# EAGLE design G778A (EAGLE 6.6.0)
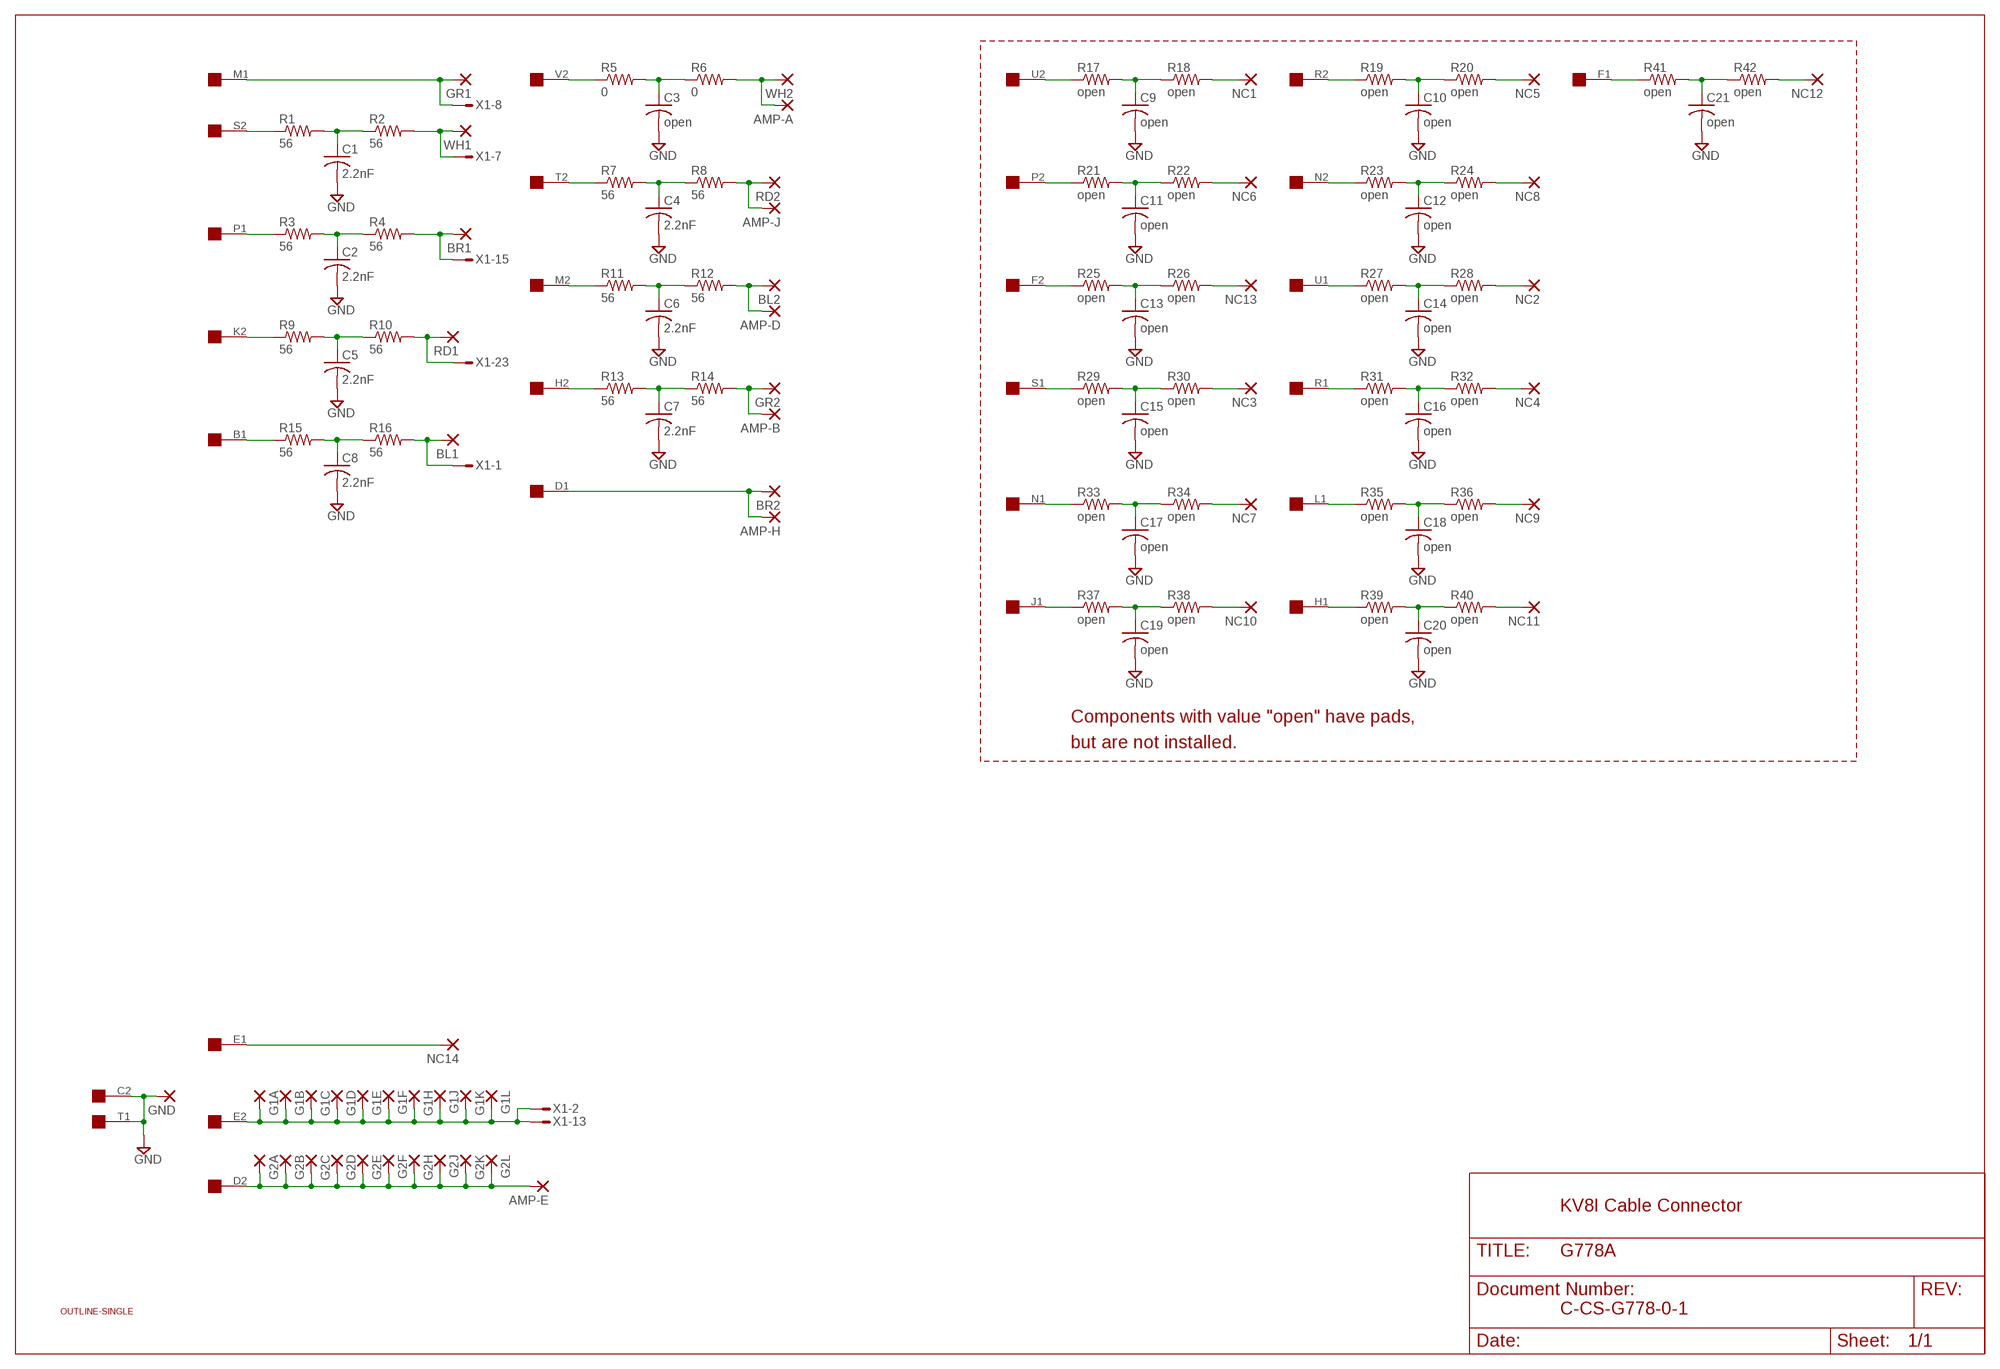
[diagram p0: schematic, sheet 1]

## Parts
AMP-A  2,54/1,0  [2,54/1,0]
AMP-B  2,54/1,0  [2,54/1,0]
AMP-D  2,54/1,0  [2,54/1,0]
AMP-E  2,54/1,0  [2,54/1,0]
AMP-H  2,54/1,0  [2,54/1,0]
AMP-J  2,54/1,0  [2,54/1,0]
BL1  2,54/1,0  [2,54/1,0]
BL2  2,54/1,0  [2,54/1,0]
BR1  2,54/1,0  [2,54/1,0]
BR2  2,54/1,0  [2,54/1,0]
C1  2.2nF  C-US102-043X133  [C102-043X133]
C2  2.2nF  C-US102-043X133  [C102-043X133]
C3  open  C-US102-043X133  [C102-043X133]
C4  2.2nF  C-US102-043X133  [C102-043X133]
C5  2.2nF  C-US102-043X133  [C102-043X133]
C6  2.2nF  C-US102-043X133  [C102-043X133]
C7  2.2nF  C-US102-043X133  [C102-043X133]
C8  2.2nF  C-US102-043X133  [C102-043X133]
C9  open  C-US102-043X133  [C102-043X133]
C10  open  C-US102-043X133  [C102-043X133]
C11  open  C-US102-043X133  [C102-043X133]
C12  open  C-US102-043X133  [C102-043X133]
C13  open  C-US102-043X133  [C102-043X133]
C14  open  C-US102-043X133  [C102-043X133]
C15  open  C-US102-043X133  [C102-043X133]
C16  open  C-US102-043X133  [C102-043X133]
C17  open  C-US102-043X133  [C102-043X133]
C18  open  C-US102-043X133  [C102-043X133]
C19  open  C-US102-043X133  [C102-043X133]
C20  open  C-US102-043X133  [C102-043X133]
C21  open  C-US102-043X133  [C102-043X133]
G1A  2,54/1,0  [2,54/1,0]
G1B  2,54/1,0  [2,54/1,0]
G1C  2,54/1,0  [2,54/1,0]
G1D  2,54/1,0  [2,54/1,0]
G1E  2,54/1,0  [2,54/1,0]
G1F  2,54/1,0  [2,54/1,0]
G1H  2,54/1,0  [2,54/1,0]
G1J  2,54/1,0  [2,54/1,0]
G1K  2,54/1,0  [2,54/1,0]
G1L  2,54/1,0  [2,54/1,0]
G2A  2,54/1,0  [2,54/1,0]
G2B  2,54/1,0  [2,54/1,0]
G2C  2,54/1,0  [2,54/1,0]
G2D  2,54/1,0  [2,54/1,0]
G2E  2,54/1,0  [2,54/1,0]
G2F  2,54/1,0  [2,54/1,0]
G2H  2,54/1,0  [2,54/1,0]
G2J  2,54/1,0  [2,54/1,0]
G2K  2,54/1,0  [2,54/1,0]
G2L  2,54/1,0  [2,54/1,0]
GND  2,54/1,0  [2,54/1,0]
GR1  2,54/1,0  [2,54/1,0]
GR2  2,54/1,0  [2,54/1,0]
NC1  2,54/1,0  [2,54/1,0]
NC2  2,54/1,0  [2,54/1,0]
NC3  2,54/1,0  [2,54/1,0]
NC4  2,54/1,0  [2,54/1,0]
NC5  2,54/1,0  [2,54/1,0]
NC6  2,54/1,0  [2,54/1,0]
NC7  2,54/1,0  [2,54/1,0]
NC8  2,54/1,0  [2,54/1,0]
NC9  2,54/1,0  [2,54/1,0]
NC10  2,54/1,0  [2,54/1,0]
NC11  2,54/1,0  [2,54/1,0]
NC12  2,54/1,0  [2,54/1,0]
NC13  2,54/1,0  [2,54/1,0]
NC14  2,54/1,0  [2,54/1,0]
R1  56  R-US_0207/10  [0207/10]
R2  56  R-US_0207/10  [0207/10]
R3  56  R-US_0207/10  [0207/10]
R4  56  R-US_0207/10  [0207/10]
R5  0  R-US_0207/10  [0207/10]
R6  0  R-US_0207/10  [0207/10]
R7  56  R-US_0207/10  [0207/10]
R8  56  R-US_0207/10  [0207/10]
R9  56  R-US_0207/10  [0207/10]
R10  56  R-US_0207/10  [0207/10]
R11  56  R-US_0207/10  [0207/10]
R12  56  R-US_0207/10  [0207/10]
R13  56  R-US_0207/10  [0207/10]
R14  56  R-US_0207/10  [0207/10]
R15  56  R-US_0207/10  [0207/10]
R16  56  R-US_0207/10  [0207/10]
R17  open  R-US_0207/10  [0207/10]
R18  open  R-US_0207/10  [0207/10]
R19  open  R-US_0207/10  [0207/10]
R20  open  R-US_0207/10  [0207/10]
R21  open  R-US_0207/10  [0207/10]
R22  open  R-US_0207/10  [0207/10]
R23  open  R-US_0207/10  [0207/10]
R24  open  R-US_0207/10  [0207/10]
R25  open  R-US_0207/10  [0207/10]
R26  open  R-US_0207/10  [0207/10]
R27  open  R-US_0207/10  [0207/10]
R28  open  R-US_0207/10  [0207/10]
R29  open  R-US_0207/10  [0207/10]
R30  open  R-US_0207/10  [0207/10]
R31  open  R-US_0207/10  [0207/10]
R32  open  R-US_0207/10  [0207/10]
R33  open  R-US_0207/10  [0207/10]
R34  open  R-US_0207/10  [0207/10]
R35  open  R-US_0207/10  [0207/10]
R36  open  R-US_0207/10  [0207/10]
R37  open  R-US_0207/10  [0207/10]
R38  open  R-US_0207/10  [0207/10]
R39  open  R-US_0207/10  [0207/10]
R40  open  R-US_0207/10  [0207/10]
R41  open  R-US_0207/10  [0207/10]
R42  open  R-US_0207/10  [0207/10]
RD1  2,54/1,0  [2,54/1,0]
RD2  2,54/1,0  [2,54/1,0]
U$1  SINGLE  [EDGE-CON2]
U$2  OUTLINE-SINGLE  [SINGLE]
WH1  2,54/1,0  [2,54/1,0]
WH2  2,54/1,0  [2,54/1,0]
X1  M25VS  [M25V]

## Nets
GND [supply]: C1.2 C2.2 C3.2 C4.2 C5.2 C6.2 C7.2 C8.2 C9.2 C10.2 C11.2 C12.2 C13.2 C14.2 C15.2 C16.2 C17.2 C18.2 C19.2 C20.2 C21.2 GND.1(P) U$1.C2 U$1.T1
N$1: C1.1 R1.2 R2.1
N$2: R1.1 U$1.S2
N$3: R2.2 WH1.1(P) X1.7
N$4: C2.1 R3.2 R4.1
N$5: R3.1 U$1.P1
N$6: BR1.1(P) R4.2 X1.15
N$7: GR1.1(P) U$1.M1 X1.8
N$8 [supply]: G1A.1(P) G1B.1(P) G1C.1(P) G1D.1(P) G1E.1(P) G1F.1(P) G1H.1(P) G1J.1(P) G1K.1(P) G1L.1(P) U$1.E2 X1.2 X1.13
N$9 [supply]: AMP-E.1(P) G2A.1(P) G2B.1(P) G2C.1(P) G2D.1(P) G2E.1(P) G2F.1(P) G2H.1(P) G2J.1(P) G2K.1(P) G2L.1(P) U$1.D2
N$10: C3.1 R5.2 R6.1
N$11: R5.1 U$1.V2
N$12: AMP-A.1(P) R6.2 WH2.1(P)
N$13: C4.1 R7.2 R8.1
N$14: R7.1 U$1.T2
N$15: AMP-J.1(P) R8.2 RD2.1(P)
N$16: C5.1 R9.2 R10.1
N$17: R9.1 U$1.K2
N$18: R10.2 RD1.1(P) X1.23
N$19: C6.1 R11.2 R12.1
N$20: R11.1 U$1.M2
N$21: AMP-D.1(P) BL2.1(P) R12.2
N$22: C7.1 R13.2 R14.1
N$23: R13.1 U$1.H2
N$24: AMP-B.1(P) GR2.1(P) R14.2
N$25: C8.1 R15.2 R16.1
N$26: R15.1 U$1.B1
N$27: BL1.1(P) R16.2 X1.1
N$28: C9.1 R17.2 R18.1
N$29: R17.1 U$1.U2
N$30: NC1.1(P) R18.2
N$31: C10.1 R19.2 R20.1
N$32: R19.1 U$1.R2
N$33: NC5.1(P) R20.2
N$34: C11.1 R21.2 R22.1
N$35: R21.1 U$1.P2
N$36: NC6.1(P) R22.2
N$37: C12.1 R23.2 R24.1
N$38: R23.1 U$1.N2
N$39: NC8.1(P) R24.2
N$40: C13.1 R25.2 R26.1
N$41: R25.1 U$1.F2
N$42: NC13.1(P) R26.2
N$43: C14.1 R27.2 R28.1
N$44: R27.1 U$1.U1
N$45: NC2.1(P) R28.2
N$46: C15.1 R29.2 R30.1
N$47: R29.1 U$1.S1
N$48: NC3.1(P) R30.2
N$49: C16.1 R31.2 R32.1
N$50: R31.1 U$1.R1
N$51: NC4.1(P) R32.2
N$52: C17.1 R33.2 R34.1
N$53: R33.1 U$1.N1
N$54: NC7.1(P) R34.2
N$55: C18.1 R35.2 R36.1
N$56: R35.1 U$1.L1
N$57: NC9.1(P) R36.2
N$58: C19.1 R37.2 R38.1
N$59: R37.1 U$1.J1
N$60: NC10.1(P) R38.2
N$61: C20.1 R39.2 R40.1
N$62: R39.1 U$1.H1
N$63: NC11.1(P) R40.2
N$64: C21.1 R41.2 R42.1
N$65: R41.1 U$1.F1
N$66: NC12.1(P) R42.2
N$67: AMP-H.1(P) BR2.1(P) U$1.D1
N$68: NC14.1(P) U$1.E1
Unconnected: U$1.A1 U$1.A2 U$1.B2 U$1.C1 U$1.J2 U$1.K1 U$1.L2 U$1.V1 X1.3 X1.4 X1.5 X1.6 X1.9 X1.10 X1.11 X1.12 X1.14 X1.16 X1.17 X1.18 X1.19 X1.20 X1.21 X1.22 X1.24 X1.25

## Notes on the sheet
- Components with value "open" have pads,
- but are not installed.
- KV8I Cable Connector
- C-CS-G778-0-1

## Library data of the parts
AMP-A AMP-B AMP-D AMP-E AMP-H AMP-J BL1 BL2 BR1 BR2 G1A G1B G1C G1D G1E G1F G1H G1J G1K G1L G2A G2B G2C G2D G2E G2F G2H G2J G2K G2L GND GR1 GR2 NC1-NC14 RD1 RD2 WH1 WH2 = wirepad:2,54/1,0: THROUGH-HOLE PAD
C1-C21 = rcl:C-US: CAPACITOR, American symbol
R1-R42 = rcl:R-US_: RESISTOR, American symbol
U$1 = dec-con:SINGLE: Single-Height DEC board
U$2 = dec-con:OUTLINE-*: Board outlines for DEC boards.
X1 = con-subd:M25?S: SUB-D; OC_FARNELL: unknown; OC_NEWARK: unknown

## Net classes
1 supply: width 0.813 mm

## Board
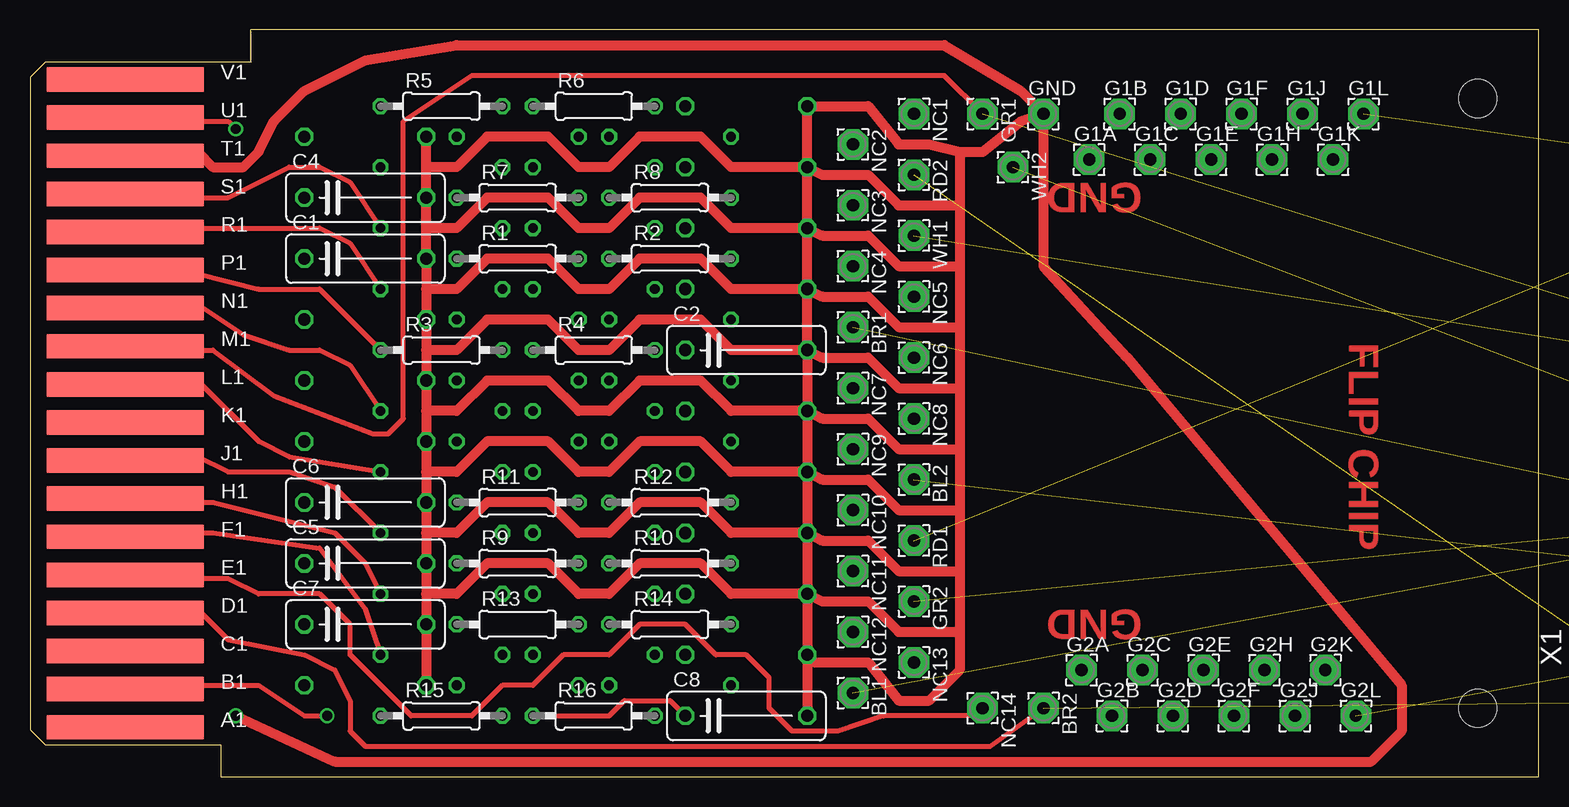
[diagram p1: board, top side]
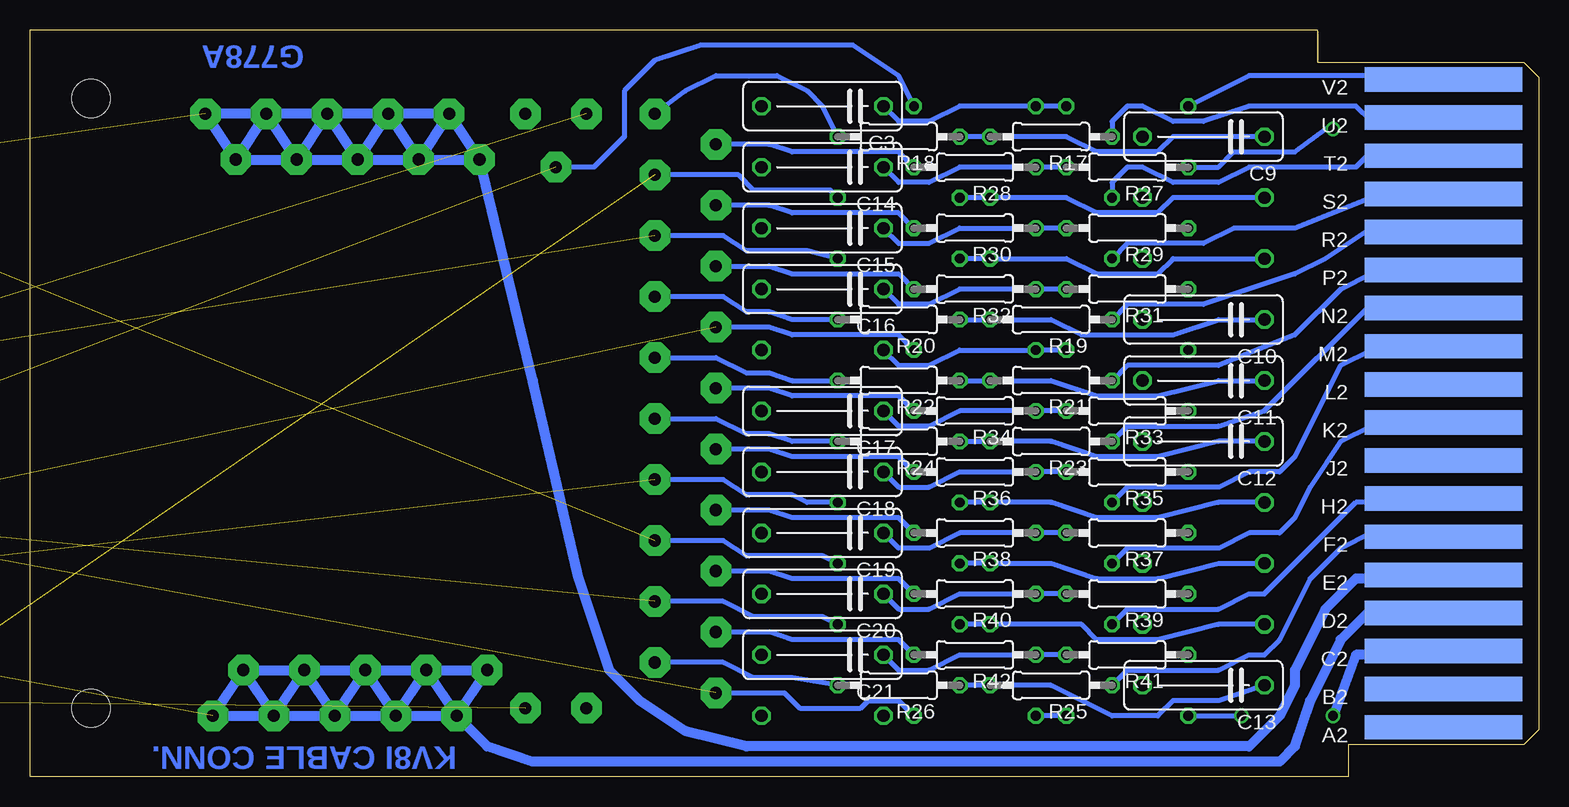
[diagram p2: board, bottom side, seen from below]

Size 125.73 x 62.23 mm. Coordinates in mm from the lower left corner, seen from the top.
Copper layers (1+16): Top 0.035mm / dielectric 1.5mm / Bottom 0.035mm
Design rules "16mils": minimum track width 16mil, minimum drill 32mil, track to track 15mil, track to pad 10mil, pad to pad 10mil, via to via 10mil, smd to smd 10mil, copper to edge 13mil, drill to drill 10mil, minimum pad ring 10mil, minimum via ring 8mil, stop-mask expansion 0mil, vias tented up to drill 0mil, thermal gap 10mil

### Footprints (pad centres in the part's own frame; a part is rotated, then mirrored left to right if it is on the bottom)
2,54/1,0 = drill 1.016 pad 2.54 octagon: 1 0,0
C102-043X133 = drill 1.016 octagon: 1 -5.08,0; 2 5.08,0
0207/10 = drill 0.813 octagon: 1 -5.08,0; 2 5.08,0
EDGE-CON2 = smd 13.106 x 2.032: A1 7.938,4.128; B1 7.938,7.303; C1 7.938,10.477; D1 7.938,13.652; E1 7.938,16.828; F1 7.938,20.003; H1 7.938,23.177; J1 7.938,26.352; K1 7.938,29.527; L1 7.938,32.703; M1 7.938,35.877; N1 7.938,39.053; P1 7.938,42.227; R1 7.938,45.403; S1 7.938,48.578; T1 7.938,51.752; U1 7.938,54.928; V1 7.938,58.102 | smd 13.106 x 2.032 bottom: A2 7.938,4.128; B2 7.938,7.303; C2 7.938,10.477; D2 7.938,13.652; E2 7.938,16.828; F2 7.938,20.003; H2 7.938,23.177; J2 7.938,26.352; K2 7.938,29.527; L2 7.938,32.703; M2 7.938,35.877; N2 7.938,39.053; P2 7.938,42.227; R2 7.938,45.403; S2 7.938,48.578; T2 7.938,51.752; U2 7.938,54.928; V2 7.938,58.102
SINGLE = hole 3.175: 120.65,56.515; 120.65,5.715
M25V = drill 1.016 octagon: 1 -16.561,1.422; 2 -13.792,1.422; 3 -11.049,1.422; 4 -8.28,1.422; 5 -5.512,1.422; 6 -2.769,1.422; 7 0,1.422; 8 2.769,1.422; 9 5.512,1.422; 10 8.28,1.422; 11 11.049,1.422; 12 13.792,1.422; 13 16.561,1.422; 14 -15.189,-1.422; 15 -12.421,-1.422; 16 -9.652,-1.422; 17 -6.909,-1.422; 18 -4.14,-1.422; 19 -1.372,-1.422; 20 1.372,-1.422; 21 4.14,-1.422; 22 6.909,-1.422; 23 9.652,-1.422; 24 12.421,-1.422; 25 15.189,-1.422 | hole 3.302: 23.52,0; -23.52,0

### Placement (x,y rotation side)
AMP-A  144.78,26.67 0 top  (outside the outline)
AMP-B  144.78,21.59 0 top  (outside the outline)
AMP-D  144.78,16.51 0 top  (outside the outline)
AMP-E  144.78,11.43 0 top  (outside the outline)
AMP-H  144.78,6.35 0 top  (outside the outline)
AMP-J  144.78,1.27 0 top  (outside the outline)
BL1  68.58,6.99 270 top
BL2  73.66,24.77 270 top
BR1  68.58,37.47 270 top
BR2  84.46,5.71 270 top
C1  27.94,43.18 0 top
C2  59.69,35.56 0 top
C3  59.69,55.88 180 bottom
C4  27.94,48.26 0 top
C5  27.94,17.78 0 top
C6  27.94,22.86 0 top
C7  27.94,12.7 0 top
C8  59.69,5.08 0 top
C9  27.94,53.34 180 bottom
C10  27.94,38.1 180 bottom
C11  27.94,33.02 180 bottom
C12  27.94,27.94 180 bottom
C13  27.94,7.62 180 bottom
C14  59.69,50.8 180 bottom
C15  59.69,45.72 180 bottom
C16  59.69,40.64 180 bottom
C17  59.69,30.48 180 bottom
C18  59.69,25.4 180 bottom
C19  59.69,20.32 180 bottom
C20  59.69,15.24 180 bottom
C21  59.69,10.16 180 bottom
G1A  88.27,51.44 0 top
G1B  90.81,55.24 0 top
G1C  93.35,51.44 0 top
G1D  95.89,55.24 0 top
G1E  98.43,51.44 0 top
G1F  100.97,55.24 0 top
G1H  103.51,51.44 0 top
G1J  106.05,55.24 0 top
G1K  108.59,51.44 0 top
G1L  111.13,55.24 0 top
G2A  87.63,8.89 0 top
G2B  90.17,5.08 0 top
G2C  92.71,8.89 0 top
G2D  95.25,5.08 0 top
G2E  97.79,8.89 0 top
G2F  100.33,5.08 0 top
G2H  102.87,8.89 0 top
G2J  105.41,5.08 0 top
G2K  107.95,8.89 0 top
G2L  110.49,5.08 0 top
GND  84.46,55.24 0 top
GR1  79.38,55.24 270 top
GR2  73.66,14.61 270 top
NC1  73.66,55.24 270 top
NC2  68.58,52.7 270 top
NC3  68.58,47.62 270 top
NC4  68.58,42.55 270 top
NC5  73.66,40.01 270 top
NC6  73.66,34.92 270 top
NC7  68.58,32.38 270 top
NC8  73.66,29.84 270 top
NC9  68.58,27.3 270 top
NC10  68.58,22.23 270 top
NC11  68.58,17.14 270 top
NC12  68.58,12.06 270 top
NC13  73.66,9.53 270 top
NC14  79.38,5.71 270 top
R1  40.64,43.18 0 top
R2  53.34,43.18 0 top
R3  34.29,35.56 0 top
R4  46.99,35.56 0 top
R5  34.29,55.88 0 top
R6  46.99,55.88 0 top
R7  40.64,48.26 0 top
R8  53.34,48.26 0 top
R9  40.64,17.78 0 top
R10  53.34,17.78 0 top
R11  40.64,22.86 0 top
R12  53.34,22.86 0 top
R13  40.64,12.7 0 top
R14  53.34,12.7 0 top
R15  34.29,5.08 0 top
R16  46.99,5.08 0 top
R17  40.64,53.34 180 bottom
R18  53.34,53.34 180 bottom
R19  40.64,38.1 180 bottom
R20  53.34,38.1 180 bottom
R21  40.64,33.02 180 bottom
R22  53.34,33.02 180 bottom
R23  40.64,27.94 180 bottom
R24  53.34,27.94 180 bottom
R25  40.64,7.62 180 bottom
R26  53.34,7.62 180 bottom
R27  34.29,50.8 180 bottom
R28  46.99,50.8 180 bottom
R29  34.29,45.72 180 bottom
R30  46.99,45.72 180 bottom
R31  34.29,40.64 180 bottom
R32  46.99,40.64 180 bottom
R33  34.29,30.48 180 bottom
R34  46.99,30.48 180 bottom
R35  34.29,25.4 180 bottom
R36  46.99,25.4 180 bottom
R37  34.29,20.32 180 bottom
R38  46.99,20.32 180 bottom
R39  34.29,15.24 180 bottom
R40  46.99,15.24 180 bottom
R41  34.29,10.16 180 bottom
R42  46.99,10.16 180 bottom
RD1  73.66,19.68 270 top
RD2  73.66,50.16 270 top
U$1  0,0 0 top
U$2  0,0 0 top
WH1  73.66,45.09 270 top
WH2  81.92,50.8 270 top
X1  134.62,35.56 90 top  (outside the outline)

### Tracks (layer width: path | path; a pad name or v marks a point on that pad's centre or on a via)
GND  (via drill 0.81)
  Top 0.813: C2.2 C16.2 | C16.2 C15.2 | C15.2 C14.2 | C14.2 C3.2 69.85,55.88 72.39,52.7 74.93,52.7 77.47,52.07 | 33.02,15.24 C5.2 C6.2 C12.2 C11.2 C10.2 C1.2 C4.2 C9.2 | 33.02,15.24 C7.2 C13.2 | C2.2 C17.2 | C17.2 C18.2 | C18.2 C19.2 | C19.2 C20.2 | C20.2 C21.2 | C21.2 C8.2 | C20.2 58.42,15.24 55.88,17.78 50.8,17.78 48.26,15.24 45.72,15.24 43.18,17.78 38.1,17.78 35.56,15.24 33.02,15.24 | U$1.T1 8.89,52.07 13.97,52.07 15.24,50.8 17.78,50.8 19.05,52.07 20.32,54.61 22.86,57.15 27.94,59.69 35.56,60.96 76.2,60.96 82.55,57.15 GND.1 | GND.1 84.46,42.55 91.44,34.92 114.3,7.62 114.3,3.81 111.76,1.27 25.4,1.27 v17.15,5.08 | 77.47,52.07 77.47,12.06 | 77.47,12.06 77.47,8.89 74.93,6.35 72.39,6.35 69.85,9.53 65.41,9.53 C21.2 | 77.47,52.07 79.38,52.07 82.55,54.61 GND.1 | C14.2 58.42,50.8 55.88,53.34 50.8,53.34 48.26,50.8 45.72,50.8 43.18,53.34 38.1,53.34 35.56,50.8 33.02,50.8 | C15.2 58.42,45.72 55.88,48.26 50.8,48.26 48.26,45.72 45.72,45.72 43.18,48.26 38.1,48.26 35.56,45.72 33.02,45.72 | C16.2 58.42,40.64 55.88,43.18 50.8,43.18 48.26,40.64 45.72,40.64 43.18,43.18 38.1,43.18 35.56,40.64 33.02,40.64 | C2.2 58.42,35.56 55.88,38.1 50.8,38.1 48.26,35.56 45.72,35.56 43.18,38.1 38.1,38.1 35.56,35.56 33.02,35.56 | C17.2 58.42,30.48 55.88,33.02 50.8,33.02 48.26,30.48 45.72,30.48 43.18,33.02 38.1,33.02 35.56,30.48 33.02,30.48 | C19.2 58.42,20.32 55.88,22.86 50.8,22.86 48.26,20.32 45.72,20.32 43.18,22.86 38.1,22.86 35.56,20.32 33.02,20.32 | C18.2 58.42,25.4 55.88,27.94 50.8,27.94 48.26,25.4 45.72,25.4 43.18,27.94 38.1,27.94 35.56,25.4 33.02,25.4 | C20.2 66.04,14.61 69.85,14.61 72.39,12.06 77.47,12.06
  Top 0.813: C14.2 66.04,50.16 69.85,50.16 72.39,47.62 77.47,47.62 | C15.2 66.04,45.09 69.85,45.09 72.39,42.55 77.47,42.55 | C16.2 66.04,40.01 69.85,40.01 72.39,37.47 77.47,37.47 | C2.2 66.04,34.92 69.85,34.92 72.39,32.38 77.47,32.38 | C17.2 66.04,29.84 69.85,29.84 72.39,27.3 77.47,27.3 | C18.2 66.04,24.77 69.85,24.77 72.39,22.23 77.47,22.23 | C19.2 66.04,19.68 69.85,19.68 72.39,17.14 77.47,17.14
  Bottom 0.813: U$1.C2 10.16,10.16 15.24,10.16 v17.15,5.08
N$1
  Bottom 0.406: R2.1 R1.2 39.37,43.18 36.83,41.91 31.75,41.91 30.48,43.18 C1.1
N$2
  Bottom 0.406: U$1.S2 13.97,48.58 13.97,48.26 20.32,45.72 25.4,45.72 27.94,44.45 34.29,44.45 R1.1
N$3  (1 unrouted)
  Bottom 0.406: R2.2 60.96,43.81 66.04,43.81 67.95,45.09 WH1.1
N$4
  Bottom 0.406: C2.1 53.34,34.29 50.8,34.29 48.26,35.56 R4.1 R3.2
N$5
  Top 0.406: U$1.P1 8.89,41.91 13.97,41.91 19.05,40.64 24.13,40.64 R3.1
N$6  (1 unrouted)
  Bottom 0.406: R4.2 53.34,36.83 62.23,36.83 64.14,37.47 BR1.1
N$7  (1 unrouted)
  Top 0.406: GR1.1 76.2,58.42 36.83,58.42 31.12,54.61 31.12,29.84 29.85,28.57 28.58,28.57 20.32,31.75 15.24,35.56 8.89,35.56 U$1.M1
N$8  (2 unrouted)
  Bottom 0.813: U$1.E2 13.97,16.51 15.24,16.51 17.78,13.97 20.32,8.89 20.32,7.62 21.59,5.08 24.13,2.54 66.04,2.54 71.12,3.81 74.93,6.35 77.47,8.89 80.01,16.51 83.82,33.02 G1A.1 | G1B.1 G1A.1 | G1C.1 G1A.1 | G1C.1 G1B.1 | G1B.1 G1D.1 | G1E.1 G1C.1 | G1E.1 G1D.1 | G1D.1 G1F.1 | G1H.1 G1E.1 | G1H.1 G1F.1 | G1F.1 G1J.1 | G1K.1 G1H.1 | G1K.1 G1J.1 | G1J.1 G1L.1 G1K.1 | G1J.1 G1H.1 | G1F.1 G1E.1 | G1C.1 G1D.1
N$9  (1 unrouted)
  Bottom 0.813: U$1.D2 10.16,13.97 13.97,13.97 16.51,11.43 19.05,6.35 20.32,2.54 21.59,1.27 83.82,1.27 87.63,2.54 G2B.1 | G2B.1 G2A.1 G2C.1 | G2C.1 G2B.1 | G2D.1 G2C.1 | G2E.1 G2C.1 | G2E.1 G2D.1 | G2D.1 G2B.1 | G2J.1 G2L.1 G2K.1 | G2J.1 G2F.1 | G2F.1 G2D.1 | G2H.1 G2E.1 | G2E.1 G2F.1 | G2F.1 G2H.1 | G2H.1 G2J.1 | G2J.1 G2K.1 | G2K.1 G2H.1
N$10
  Bottom 0.406: R5.2 R6.1 48.26,55.88 50.8,54.61 53.34,54.61 C3.1
N$11
  Bottom 0.406: U$1.V2 8.89,58.42 24.13,58.42 R5.1
N$12  (1 unrouted)
  Bottom 0.406: R6.2 53.34,58.42 57.15,60.96 69.85,60.96 73.66,59.69 76.2,57.15 76.2,53.34 78.74,50.8 WH2.1
N$13
  Bottom 0.406: C4.1 30.48,48.26 31.75,46.99 36.83,46.99 39.37,48.26 R7.2 R8.1
N$14
  Bottom 0.406: U$1.T2 8.89,52.07 13.97,52.07 15.24,50.8 24.13,50.8 26.67,49.53 30.48,49.53 33.02,50.8 34.29,50.8 35.56,49.53 R7.1
N$15  (1 unrouted)
  Bottom 0.406: R8.2 59.06,48.9 65.41,48.9 66.68,50.16 RD2.1
N$16
  Bottom 0.406: R10.1 R9.2 40.64,17.78 36.83,16.51 31.75,16.51 26.67,17.78 C5.1
N$17
  Bottom 0.406: U$1.K2 8.89,29.21 13.97,29.21 16.51,27.94 19.05,24.13 20.32,21.59 21.59,20.32 24.13,20.32 26.67,19.05 34.29,19.05 R9.1
N$18  (1 unrouted)
  Bottom 0.406: R10.2 59.69,18.41 66.04,18.41 67.95,19.68 RD1.1
N$19
  Bottom 0.406: R12.1 R11.2 40.64,22.86 36.83,21.59 31.75,21.59 26.67,22.86 C6.1
N$20
  Bottom 0.406: U$1.M2 8.89,35.56 13.97,35.56 16.51,34.29 20.32,26.67 21.59,25.4 24.13,25.4 26.67,24.13 34.29,24.13 R11.1
N$21  (1 unrouted)
  Bottom 0.406: R12.2 60.96,22.86 62.23,23.5 66.04,23.5 67.95,24.77 BL2.1
N$22
  Bottom 0.406: R14.1 R13.2 38.1,12.7 36.83,11.43 31.75,11.43 26.67,12.7 C7.1
N$23
  Bottom 0.406: R13.1 34.29,13.97 26.67,13.97 24.13,15.24 22.86,15.24 15.24,22.86 8.89,22.86 U$1.H2
N$24  (1 unrouted)
  Bottom 0.406: R14.2 59.69,13.34 65.41,13.34 67.95,14.61 GR2.1
N$25
  Top 0.406: R16.1 48.26,5.08 49.53,6.35 53.34,6.35 C8.1
  Bottom 0.406: R15.2 R16.1
N$26  (via drill 0.81)
  Top 0.406: U$1.B1 8.89,7.62 19.05,7.62 22.86,5.08 v24.77,5.08
  Bottom 0.406: R15.1 v24.77,5.08
N$27  (1 unrouted)
  Bottom 0.406: R16.2 53.34,6.35 55.88,6.35 56.52,5.71 61.6,5.71 62.87,6.99 BL1.1
N$28
  Bottom 0.406: R18.1 R17.2 39.37,53.34 36.83,52.07 31.75,52.07 30.48,53.34 C9.1
N$29
  Bottom 0.406: U$1.U2 8.89,54.61 13.97,54.61 15.24,55.88 24.13,55.88 27.94,54.61 30.48,54.61 33.02,55.88 34.29,55.88 35.56,54.61 R17.1
N$30
  Bottom 0.406: NC1.1 71.12,57.15 68.58,58.42 63.5,58.42 60.96,57.15 59.69,55.88 R18.2
N$31
  Bottom 0.406: R20.1 R19.2 40.64,38.1 38.1,36.83 30.48,36.83 26.67,38.1 C10.1
N$32
  Bottom 0.406: U$1.R2 8.89,45.72 13.97,45.72 17.78,43.18 20.32,41.91 27.94,39.37 34.29,39.37 R19.1
N$33
  Bottom 0.406: R20.2 62.23,38.1 64.14,38.73 66.04,38.73 67.95,40.01 NC5.1
N$34
  Bottom 0.406: R22.1 R21.2 40.64,33.02 36.83,31.75 31.75,31.75 26.67,33.02 C11.1
N$35
  Bottom 0.406: U$1.P2 10.16,41.91 13.97,41.91 16.51,40.64 20.32,36.83 26.67,34.29 34.29,34.29 R21.1
N$36
  Bottom 0.406: NC6.1 68.58,34.92 66.04,33.66 64.14,33.66 62.23,33.02 R22.2
N$37
  Bottom 0.406: C12.1 26.67,27.94 31.75,26.67 36.83,26.67 40.64,27.94 R23.2 R24.1
N$38
  Bottom 0.406: R23.1 34.29,29.21 26.67,29.21 22.86,30.48 13.97,39.37 8.89,39.37 U$1.N2
N$39
  Bottom 0.406: NC8.1 68.58,29.84 66.04,28.57 64.14,28.57 62.23,27.94 R24.2
N$40
  Bottom 0.406: C13.1 26.67,6.35 30.48,6.35 31.75,5.08 35.56,5.08 40.64,7.62 R25.2 R26.1
N$41
  Bottom 0.406: R25.1 34.29,8.89 26.67,8.89 24.13,10.16 22.86,10.16 21.59,11.43 19.05,16.51 16.51,19.05 13.97,20.32 8.89,20.32 U$1.F2
N$42
  Bottom 0.406: R26.2 62.23,8.26 65.41,8.26 67.95,9.53 NC13.1
N$43
  Bottom 0.406: R27.2 R28.1 48.26,50.8 50.8,49.53 53.34,49.53 C14.1
N$44  (via drill 0.81)
  Top 0.406: U$1.U1 10.16,54.61 16.51,54.61 v17.15,53.98
  Bottom 0.406: R27.1 26.67,50.8 25.4,52.07 20.32,52.07 17.78,53.98 v17.15,53.98
N$45
  Bottom 0.406: R28.2 53.34,52.07 62.23,52.07 64.14,52.7 NC2.1
N$46
  Bottom 0.406: R29.2 R30.1 48.26,45.72 50.8,44.45 53.34,44.45 C15.1
N$47
  Top 0.406: U$1.S1 10.16,48.26 16.51,48.26 21.59,50.8 24.13,50.8 26.67,49.53 R29.1
N$48
  Bottom 0.406: R30.2 53.34,46.99 62.23,46.99 64.14,47.62 NC3.1
N$49
  Bottom 0.406: R31.2 R32.1 48.26,40.64 50.8,39.37 53.34,39.37 C16.1
N$50
  Top 0.406: U$1.R1 8.89,45.72 24.13,45.72 26.67,44.45 R31.1
N$51
  Bottom 0.406: NC4.1 64.14,42.55 62.23,41.91 53.34,41.91 R32.2
N$52
  Bottom 0.406: R33.2 R34.1 48.26,30.48 50.8,29.21 53.34,29.21 C17.1
N$53
  Top 0.406: U$1.N1 8.89,39.37 13.97,39.37 17.78,36.83 21.59,35.56 24.13,35.56 26.67,34.29 R33.1
N$54
  Bottom 0.406: R34.2 53.34,31.75 62.23,31.75 64.14,32.38 NC7.1
N$55
  Bottom 0.406: C18.1 53.34,24.13 50.8,24.13 48.26,25.4 R36.1 R35.2
N$56
  Top 0.406: U$1.L1 8.89,33.02 13.97,33.02 19.05,27.94 21.59,26.67 R35.1
N$57
  Bottom 0.406: R36.2 53.34,26.67 62.23,26.67 64.14,27.3 NC9.1
N$58
  Bottom 0.406: R37.2 R38.1 48.26,20.32 50.8,19.05 53.34,19.05 C19.1
N$59
  Top 0.406: U$1.J1 8.89,26.67 13.97,26.67 16.51,25.4 21.59,25.4 25.4,24.13 R37.1
N$60
  Bottom 0.406: R38.2 53.34,21.59 62.23,21.59 64.14,22.23 NC10.1
N$61
  Bottom 0.406: R39.2 R40.1 48.26,15.24 50.8,13.97 53.34,13.97 C20.1
N$62
  Top 0.406: U$1.H1 8.89,22.86 15.24,22.86 25.4,20.32 27.94,17.78 R39.1
N$63
  Bottom 0.406: R40.2 53.34,16.51 62.23,16.51 64.14,17.14 NC11.1
N$64
  Bottom 0.406: C21.1 53.34,8.89 50.8,8.89 48.26,10.16 R42.1 R41.2
N$65
  Top 0.406: U$1.F1 8.89,20.32 15.24,20.32 24.13,19.05 27.94,13.97 R41.1
N$66
  Bottom 0.406: NC12.1 64.14,12.06 62.23,11.43 53.34,11.43 R42.2
N$67  (1 unrouted)
  Top 0.406: U$1.D1 8.89,13.97 13.97,13.97 16.51,11.43 22.86,10.16 25.4,8.89 26.67,6.35 26.67,3.81 27.94,2.54 80.01,2.54 BR2.1
N$68
  Top 0.406: NC14.1 78.74,5.08 71.12,5.08 67.31,3.81 63.5,3.81 61.6,5.71 61.6,8.26 59.69,10.16 57.15,10.16 54.61,12.7 50.8,12.7 48.26,10.16 44.45,10.16 41.91,7.62 39.37,7.62 36.83,5.08 31.75,5.08 26.67,10.16 26.67,12.7 24.13,15.24 19.05,15.24 16.51,16.51 8.89,16.51 U$1.E1

### Text on the board
Top: GND | FLIP CHIP | GND
Bottom: G778A | KV8I CABLE CONN.
Document: Components on solder side (value "open") are not installed.